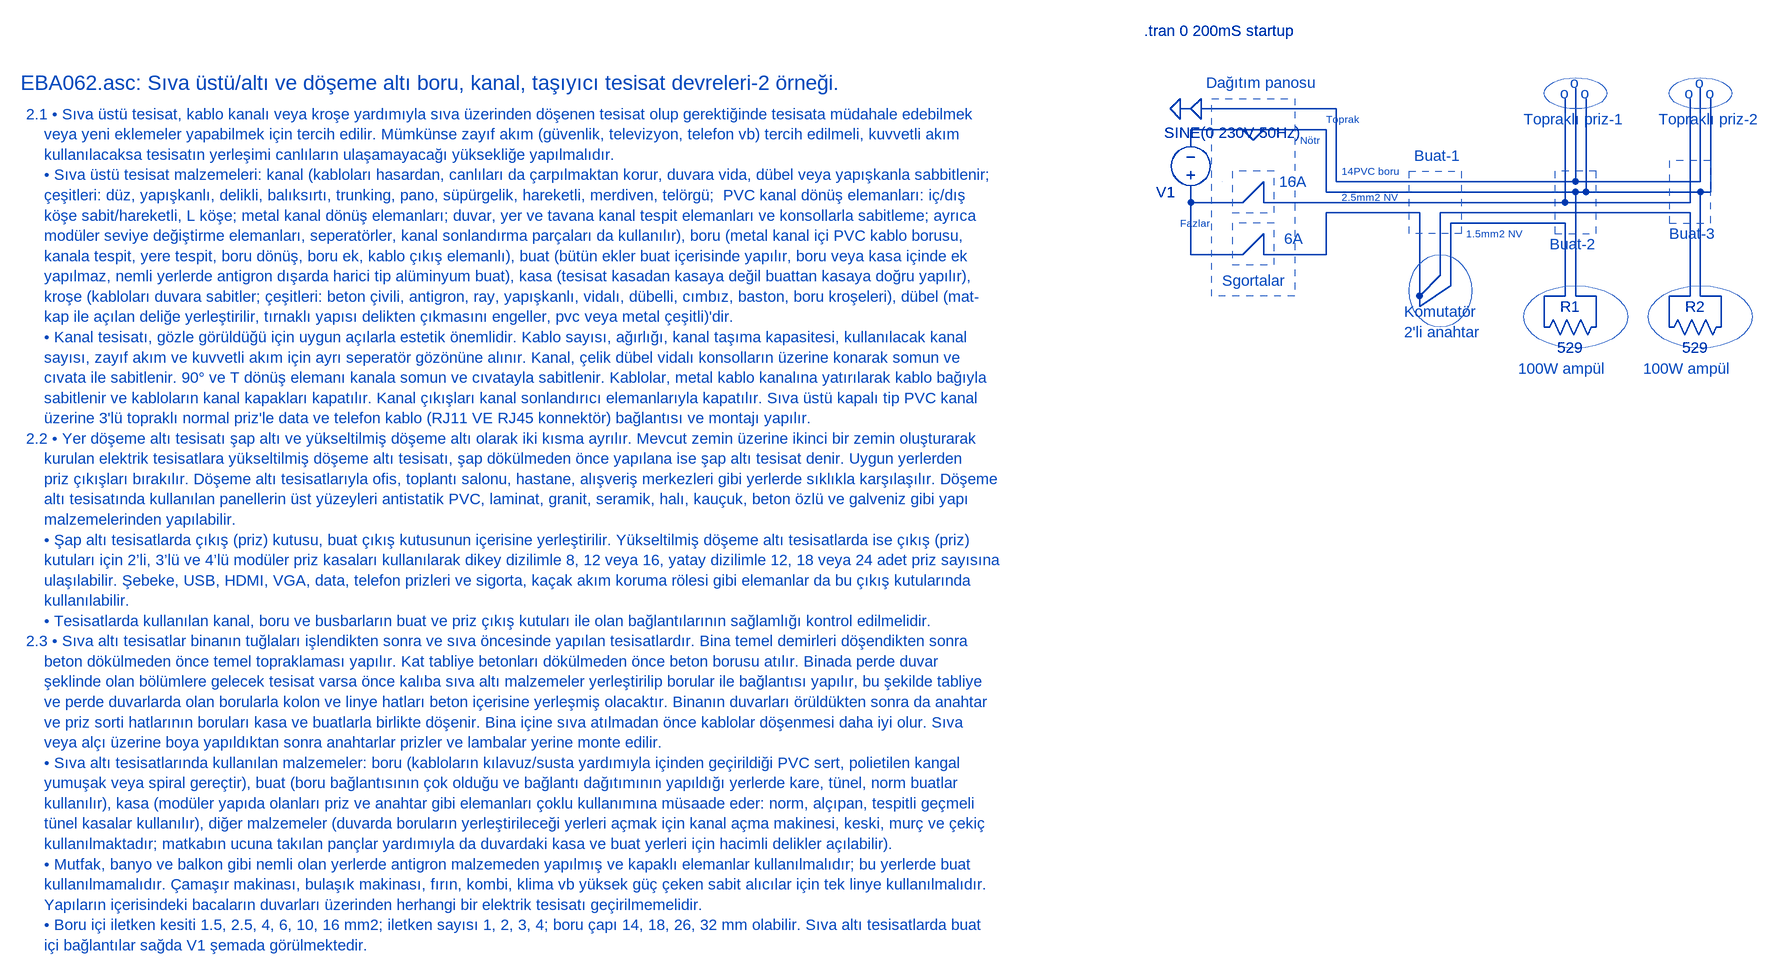
[diagram p0: schematic EBA062.asc]
EBA062.asc, the LTspice schematic file:
Version 4
SHEET 1 4076 2612
WIRE 1648 80 1632 80
WIRE 1872 80 1664 80
WIRE 1744 112 1648 112
WIRE 1856 112 1744 112
WIRE 1648 128 1648 112
WIRE 1872 192 1872 80
WIRE 2240 192 2240 48
WIRE 2240 192 1872 192
WIRE 2432 192 2432 48
WIRE 2432 192 2240 192
WIRE 1856 208 1856 112
WIRE 2240 208 1856 208
WIRE 2256 208 2256 64
WIRE 2256 208 2240 208
WIRE 2432 208 2256 208
WIRE 2448 208 2448 64
WIRE 2448 208 2432 208
WIRE 1648 224 1648 208
WIRE 1728 224 1760 192
WIRE 1728 224 1648 224
WIRE 1760 224 1760 192
WIRE 2224 224 2224 64
WIRE 2224 224 1760 224
WIRE 2416 224 2416 64
WIRE 2416 224 2224 224
WIRE 2000 240 1856 240
WIRE 2416 240 2032 240
WIRE 2224 256 2048 256
WIRE 1648 304 1648 224
WIRE 1728 304 1760 272
WIRE 1728 304 1648 304
WIRE 1760 304 1760 272
WIRE 1856 304 1856 240
WIRE 1856 304 1760 304
WIRE 2032 336 2032 240
WIRE 2048 352 2048 256
WIRE 2000 368 2000 240
WIRE 2000 368 2032 336
WIRE 2224 368 2224 256
WIRE 2224 368 2192 368
WIRE 2240 368 2240 208
WIRE 2272 368 2240 368
WIRE 2416 368 2416 240
WIRE 2416 368 2384 368
WIRE 2432 368 2432 208
WIRE 2464 368 2432 368
WIRE 2000 384 2048 352
WIRE 2000 384 2000 368
WIRE 2192 416 2192 368
WIRE 2272 416 2272 368
WIRE 2384 416 2384 368
WIRE 2464 416 2464 368
FLAG 1664 80 0
FLAG 1632 80 0
FLAG 1744 112 0
SYMBOL voltage 1648 224 R180
WINDOW 3 -171 107 Left 2
WINDOW 123 0 0 Left 0
WINDOW 39 0 0 Left 0
SYMATTR Value SINE(0 230V 50Hz)
SYMATTR InstName V1
SYMBOL res 2288 400 R90
WINDOW 0 0 56 VBottom 2
WINDOW 3 32 56 VTop 2
SYMATTR InstName R1
SYMATTR Value 529
SYMBOL res 2480 400 R90
WINDOW 0 0 56 VBottom 2
WINDOW 3 32 56 VTop 2
SYMATTR InstName R2
SYMATTR Value 529
TEXT -152 40 Left 3 ;EBA062.asc: Sıva üstü/altı ve döşeme altı boru, kanal, taşıyıcı tesisat devreleri-2 örneği.
TEXT -144 88 Left 2 ;2.1 • Sıva üstü tesisat, kablo kanalı veya kroşe yardımıyla sıva üzerinden döşenen tesisat olup gerektiğinde tesisata müdahale edebilmek\n    veya yeni eklemeler yapabilmek için tercih edilir. Mümkünse zayıf akım (güvenlik, televizyon, telefon vb) tercih edilmeli, kuvvetli akım \n    kullanılacaksa tesisatın yerleşimi canlıların ulaşamayacağı yüksekliğe yapılmalıdır.\n    • Sıva üstü tesisat malzemeleri: kanal (kabloları hasardan, canlıları da çarpılmaktan korur, duvara vida, dübel veya yapışkanla sabbitlenir;\n    çeşitleri: düz, yapışkanlı, delikli, balıksırtı, trunking, pano, süpürgelik, hareketli, merdiven, telörgü;  PVC kanal dönüş elemanları: iç/dış \n    köşe sabit/hareketli, L köşe; metal kanal dönüş elemanları; duvar, yer ve tavana kanal tespit elemanları ve konsollarla sabitleme; ayrıca\n    modüler seviye değiştirme elemanları, seperatörler, kanal sonlandırma parçaları da kullanılır), boru (metal kanal içi PVC kablo borusu,\n    kanala tespit, yere tespit, boru dönüş, boru ek, kablo çıkış elemanlı), buat (bütün ekler buat içerisinde yapılır, boru veya kasa içinde ek\n    yapılmaz, nemli yerlerde antigron dışarda harici tip alüminyum buat), kasa (tesisat kasadan kasaya değil buattan kasaya doğru yapılır),\n    kroşe (kabloları duvara sabitler; çeşitleri: beton çivili, antigron, ray, yapışkanlı, vidalı, dübelli, cımbız, baston, boru kroşeleri), dübel (mat-\n    kap ile açılan deliğe yerleştirilir, tırnaklı yapısı delikten çıkmasını engeller, pvc veya metal çeşitli)'dir.\n    • Kanal tesisatı, gözle görüldüğü için uygun açılarla estetik önemlidir. Kablo sayısı, ağırlığı, kanal taşıma kapasitesi, kullanılacak kanal\n    sayısı, zayıf akım ve kuvvetli akım için ayrı seperatör gözönüne alınır. Kanal, çelik dübel vidalı konsolların üzerine konarak somun ve \n    cıvata ile sabitlenir. 90° ve T dönüş elemanı kanala somun ve cıvatayla sabitlenir. Kablolar, metal kablo kanalına yatırılarak kablo bağıyla\n    sabitlenir ve kabloların kanal kapakları kapatılır. Kanal çıkışları kanal sonlandırıcı elemanlarıyla kapatılır. Sıva üstü kapalı tip PVC kanal \n    üzerine 3'lü topraklı normal priz'le data ve telefon kablo (RJ11 VE RJ45 konnektör) bağlantısı ve montajı yapılır.\n2.2 • Yer döşeme altı tesisatı şap altı ve yükseltilmiş döşeme altı olarak iki kısma ayrılır. Mevcut zemin üzerine ikinci bir zemin oluşturarak \n    kurulan elektrik tesisatlara yükseltilmiş döşeme altı tesisatı, şap dökülmeden önce yapılana ise şap altı tesisat denir. Uygun yerlerden \n    priz çıkışları bırakılır. Döşeme altı tesisatlarıyla ofis, toplantı salonu, hastane, alışveriş merkezleri gibi yerlerde sıklıkla karşılaşılır. Döşeme \n    altı tesisatında kullanılan panellerin üst yüzeyleri antistatik PVC, laminat, granit, seramik, halı, kauçuk, beton özlü ve galveniz gibi yapı\n    malzemelerinden yapılabilir.\n    • Şap altı tesisatlarda çıkış (priz) kutusu, buat çıkış kutusunun içerisine yerleştirilir. Yükseltilmiş döşeme altı tesisatlarda ise çıkış (priz) \n    kutuları için 2’li, 3’lü ve 4’lü modüler priz kasaları kullanılarak dikey dizilimle 8, 12 veya 16, yatay dizilimle 12, 18 veya 24 adet priz sayısına\n    ulaşılabilir. Şebeke, USB, HDMI, VGA, data, telefon prizleri ve sigorta, kaçak akım koruma rölesi gibi elemanlar da bu çıkış kutularında\n    kullanılabilir.\n    • Tesisatlarda kullanılan kanal, boru ve busbarların buat ve priz çıkış kutuları ile olan bağlantılarının sağlamlığı kontrol edilmelidir.\n2.3 • Sıva altı tesisatlar binanın tuğlaları işlendikten sonra ve sıva öncesinde yapılan tesisatlardır. Bina temel demirleri döşendikten sonra \n    beton dökülmeden önce temel topraklaması yapılır. Kat tabliye betonları dökülmeden önce beton borusu atılır. Binada perde duvar \n    şeklinde olan bölümlere gelecek tesisat varsa önce kalıba sıva altı malzemeler yerleştirilip borular ile bağlantısı yapılır, bu şekilde tabliye\n    ve perde duvarlarda olan borularla kolon ve linye hatları beton içerisine yerleşmiş olacaktır. Binanın duvarları örüldükten sonra da anahtar\n    ve priz sorti hatlarının boruları kasa ve buatlarla birlikte döşenir. Bina içine sıva atılmadan önce kablolar döşenmesi daha iyi olur. Sıva \n    veya alçı üzerine boya yapıldıktan sonra anahtarlar prizler ve lambalar yerine monte edilir.\n    • Sıva altı tesisatlarında kullanılan malzemeler: boru (kabloların kılavuz/susta yardımıyla içinden geçirildiği PVC sert, polietilen kangal\n    yumuşak veya spiral gereçtir), buat (boru bağlantısının çok olduğu ve bağlantı dağıtımının yapıldığı yerlerde kare, tünel, norm buatlar \n    kullanılır), kasa (modüler yapıda olanları priz ve anahtar gibi elemanları çoklu kullanımına müsaade eder: norm, alçıpan, tespitli geçmeli \n    tünel kasalar kullanılır), diğer malzemeler (duvarda boruların yerleştirileceği yerleri açmak için kanal açma makinesi, keski, murç ve çekiç \n    kullanılmaktadır; matkabın ucuna takılan pançlar yardımıyla da duvardaki kasa ve buat yerleri için hacimli delikler açılabilir).\n    • Mutfak, banyo ve balkon gibi nemli olan yerlerde antigron malzemeden yapılmış ve kapaklı elemanlar kullanılmalıdır; bu yerlerde buat \n    kullanılmamalıdır. Çamaşır makinası, bulaşık makinası, fırın, kombi, klima vb yüksek güç çeken sabit alıcılar için tek linye kullanılmalıdır.\n    Yapıların içerisindeki bacaların duvarları üzerinden herhangi bir elektrik tesisatı geçirilmemelidir.\n    • Boru içi iletken kesiti 1.5, 2.5, 4, 6, 10, 16 mm2; iletken sayısı 1, 2, 3, 4; boru çapı 14, 18, 26, 32 mm olabilir. Sıva altı tesisatlarda buat \n    içi bağlantılar sağda V1 şemada görülmektedir.
TEXT 1784 192 Left 2 ;16A
TEXT 1792 280 Left 2 ;6A
TEXT 1696 344 Left 2 ;Sgortalar
TEXT 1976 392 Left 2 ;Komutatör\n2'li anahtar
TEXT 2152 480 Left 2 ;100W ampül
TEXT 2344 480 Left 2 ;100W ampül
TEXT 2216 56 Left 2 ;o
TEXT 2232 40 Left 2 ;o
TEXT 2248 56 Left 2 ;o
TEXT 2408 56 Left 2 ;o
TEXT 2440 56 Left 2 ;o
TEXT 2424 40 Left 2 ;o
TEXT 2160 96 Left 2 ;Topraklı priz-1
TEXT 2368 96 Left 2 ;Topraklı priz-2
TEXT 2200 288 Left 2 ;Buat-2
TEXT 2384 272 Left 2 ;Buat-3
TEXT 1672 40 Left 2 ;Dağıtım panosu
TEXT 1856 96 Left 1 ;Toprak
TEXT 1816 128 Left 1 ;Nötr
TEXT 1632 256 Left 1 ;Fazlar
TEXT 1576 -40 Left 2 !.tran 0 200mS startup
TEXT 1880 176 Left 1 ;14PVC boru
TEXT 1880 216 Left 1 ;2.5mm2 NV
TEXT 2072 272 Left 1 ;1.5mm2 NV
TEXT 1992 152 Left 2 ;Buat-1
RECTANGLE Normal 1696 192 1696 192 2
RECTANGLE Normal 1712 240 1776 176 2
RECTANGLE Normal 1712 320 1776 256 2
RECTANGLE Normal 2272 176 2208 272 2
RECTANGLE Normal 2448 160 2384 256 2
RECTANGLE Normal 1808 368 1680 64 2
RECTANGLE Normal 1984 176 2064 272 2
CIRCLE Normal 2080 304 1984 416 2
CIRCLE Normal 2320 352 2160 448 2
CIRCLE Normal 2512 352 2352 448 2
CIRCLE Normal 2288 80 2192 32 2
CIRCLE Normal 2480 80 2384 32 2

The netlist it stands for:
* EBA062.asc
V1 N001 0 SINE(0 230V 50Hz)
R1 0 N001 529
R2 0 N001 529
* EBA062.asc: Sıva üstü/altı ve döşeme altı boru, kanal, taşıyıcı tesisat devreleri-2 örneği.
* 2.1 • Sıva üstü tesisat, kablo kanalı veya kroşe yardımıyla sıva üzerinden döşenen tesisat olup gerektiğinde tesisata müdahale edebilmek
*     veya yeni eklemeler yapabilmek için tercih edilir. Mümkünse zayıf akım (güvenlik, televizyon, telefon vb) tercih edilmeli, kuvvetli akım
*     kullanılacaksa tesisatın yerleşimi canlıların ulaşamayacağı yüksekliğe yapılmalıdır.
*     • Sıva üstü tesisat malzemeleri: kanal (kabloları hasardan, canlıları da çarpılmaktan korur, duvara vida, dübel veya yapışkanla sabbitlenir;
*     çeşitleri: düz, yapışkanlı, delikli, balıksırtı, trunking, pano, süpürgelik, hareketli, merdiven, telörgü;  PVC kanal dönüş elemanları: iç/dış
*     köşe sabit/hareketli, L köşe; metal kanal dönüş elemanları; duvar, yer ve tavana kanal tespit elemanları ve konsollarla sabitleme; ayrıca
*     modüler seviye değiştirme elemanları, seperatörler, kanal sonlandırma parçaları da kullanılır), boru (metal kanal içi PVC kablo borusu,
*     kanala tespit, yere tespit, boru dönüş, boru ek, kablo çıkış elemanlı), buat (bütün ekler buat içerisinde yapılır, boru veya kasa içinde ek
*     yapılmaz, nemli yerlerde antigron dışarda harici tip alüminyum buat), kasa (tesisat kasadan kasaya değil buattan kasaya doğru yapılır),
*     kroşe (kabloları duvara sabitler; çeşitleri: beton çivili, antigron, ray, yapışkanlı, vidalı, dübelli, cımbız, baston, boru kroşeleri), dübel (mat-
*     kap ile açılan deliğe yerleştirilir, tırnaklı yapısı delikten çıkmasını engeller, pvc veya metal çeşitli)'dir.
*     • Kanal tesisatı, gözle görüldüğü için uygun açılarla estetik önemlidir. Kablo sayısı, ağırlığı, kanal taşıma kapasitesi, kullanılacak kanal
*     sayısı, zayıf akım ve kuvvetli akım için ayrı seperatör gözönüne alınır. Kanal, çelik dübel vidalı konsolların üzerine konarak somun ve
*     cıvata ile sabitlenir. 90° ve T dönüş elemanı kanala somun ve cıvatayla sabitlenir. Kablolar, metal kablo kanalına yatırılarak kablo bağıyla
*     sabitlenir ve kabloların kanal kapakları kapatılır. Kanal çıkışları kanal sonlandırıcı elemanlarıyla kapatılır. Sıva üstü kapalı tip PVC kanal
*     üzerine 3'lü topraklı normal priz'le data ve telefon kablo (RJ11 VE RJ45 konnektör) bağlantısı ve montajı yapılır.
* 2.2 • Yer döşeme altı tesisatı şap altı ve yükseltilmiş döşeme altı olarak iki kısma ayrılır. Mevcut zemin üzerine ikinci bir zemin oluşturarak
*     kurulan elektrik tesisatlara yükseltilmiş döşeme altı tesisatı, şap dökülmeden önce yapılana ise şap altı tesisat denir. Uygun yerlerden
*     priz çıkışları bırakılır. Döşeme altı tesisatlarıyla ofis, toplantı salonu, hastane, alışveriş merkezleri gibi yerlerde sıklıkla karşılaşılır. Döşeme
*     altı tesisatında kullanılan panellerin üst yüzeyleri antistatik PVC, laminat, granit, seramik, halı, kauçuk, beton özlü ve galveniz gibi yapı
*     malzemelerinden yapılabilir.
*     • Şap altı tesisatlarda çıkış (priz) kutusu, buat çıkış kutusunun içerisine yerleştirilir. Yükseltilmiş döşeme altı tesisatlarda ise çıkış (priz)
*     kutuları için 2’li, 3’lü ve 4’lü modüler priz kasaları kullanılarak dikey dizilimle 8, 12 veya 16, yatay dizilimle 12, 18 veya 24 adet priz sayısına
*     ulaşılabilir. Şebeke, USB, HDMI, VGA, data, telefon prizleri ve sigorta, kaçak akım koruma rölesi gibi elemanlar da bu çıkış kutularında
*     kullanılabilir.
*     • Tesisatlarda kullanılan kanal, boru ve busbarların buat ve priz çıkış kutuları ile olan bağlantılarının sağlamlığı kontrol edilmelidir.
* 2.3 • Sıva altı tesisatlar binanın tuğlaları işlendikten sonra ve sıva öncesinde yapılan tesisatlardır. Bina temel demirleri döşendikten sonra
*     beton dökülmeden önce temel topraklaması yapılır. Kat tabliye betonları dökülmeden önce beton borusu atılır. Binada perde duvar
*     şeklinde olan bölümlere gelecek tesisat varsa önce kalıba sıva altı malzemeler yerleştirilip borular ile bağlantısı yapılır, bu şekilde tabliye
*     ve perde duvarlarda olan borularla kolon ve linye hatları beton içerisine yerleşmiş olacaktır. Binanın duvarları örüldükten sonra da anahtar
*     ve priz sorti hatlarının boruları kasa ve buatlarla birlikte döşenir. Bina içine sıva atılmadan önce kablolar döşenmesi daha iyi olur. Sıva
*     veya alçı üzerine boya yapıldıktan sonra anahtarlar prizler ve lambalar yerine monte edilir.
*     • Sıva altı tesisatlarında kullanılan malzemeler: boru (kabloların kılavuz/susta yardımıyla içinden geçirildiği PVC sert, polietilen kangal
*     yumuşak veya spiral gereçtir), buat (boru bağlantısının çok olduğu ve bağlantı dağıtımının yapıldığı yerlerde kare, tünel, norm buatlar
*     kullanılır), kasa (modüler yapıda olanları priz ve anahtar gibi elemanları çoklu kullanımına müsaade eder: norm, alçıpan, tespitli geçmeli
*     tünel kasalar kullanılır), diğer malzemeler (duvarda boruların yerleştirileceği yerleri açmak için kanal açma makinesi, keski, murç ve çekiç
*     kullanılmaktadır; matkabın ucuna takılan pançlar yardımıyla da duvardaki kasa ve buat yerleri için hacimli delikler açılabilir).
*     • Mutfak, banyo ve balkon gibi nemli olan yerlerde antigron malzemeden yapılmış ve kapaklı elemanlar kullanılmalıdır; bu yerlerde buat
*     kullanılmamalıdır. Çamaşır makinası, bulaşık makinası, fırın, kombi, klima vb yüksek güç çeken sabit alıcılar için tek linye kullanılmalıdır.
*     Yapıların içerisindeki bacaların duvarları üzerinden herhangi bir elektrik tesisatı geçirilmemelidir.
*     • Boru içi iletken kesiti 1.5, 2.5, 4, 6, 10, 16 mm2; iletken sayısı 1, 2, 3, 4; boru çapı 14, 18, 26, 32 mm olabilir. Sıva altı tesisatlarda buat
*     içi bağlantılar sağda V1 şemada görülmektedir.
* 16A
* 6A
* Sgortalar
* Komutatör
* 2'li anahtar
* 100W ampül
* 100W ampül
* o
* o
* o
* o
* o
* o
* Topraklı priz-1
* Topraklı priz-2
* Buat-2
* Buat-3
* Dağıtım panosu
* Toprak
* Nötr
* Fazlar
.tran 0 200mS startup
* 14PVC boru
* 2.5mm2 NV
* 1.5mm2 NV
* Buat-1
.backanno
.end